# Altium schematic sheet smarthome_SZH_SSBH-011.SchDoc
size A4
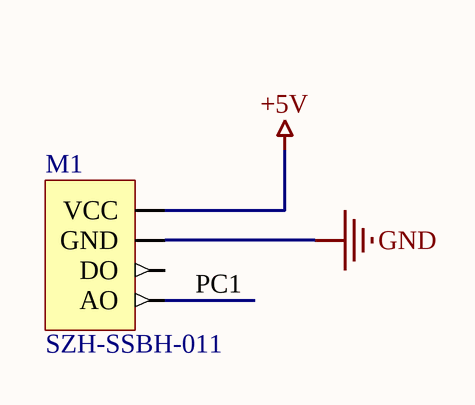
[diagram p0: smarthome_SZH_SSBH-011.SchDoc]

## Parts
M1  SZH-SSBH-011

## Nets
+5V: M1.1(VCC)
GND: M1.2(GND)
PC1: M1.4(AO)

Not connected (* = marked no-connect by the designer): M1 3(DO)